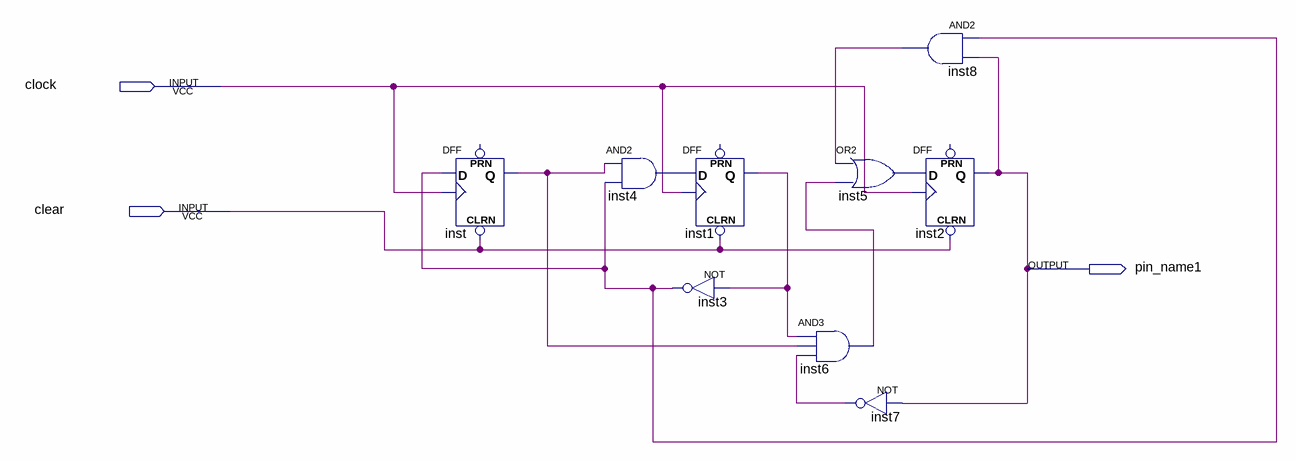
[diagram p0: schematic sheet]
// Quartus schematic Lab6.bdf as structural Verilog: 9 symbols, 3 pins
module Lab6 (
  input  clock,
  input  clear,
  output pin_name1
);

  wire inst1_q, inst3_out, inst4_out, inst5_out, inst6_out, inst7_out, inst8_out, inst_q;

  DFF inst (.CLRN(clear), .CLK(clock), .D(inst3_out), .Q(inst_q));  // open: PRN
  and inst4 (inst4_out, inst_q, inst3_out);
  DFF inst1 (.CLRN(clear), .CLK(clock), .D(inst4_out), .Q(inst1_q));  // open: PRN
  not inst3 (inst3_out, inst1_q);
  or inst5 (inst5_out, inst8_out, inst6_out);
  and inst6 (inst6_out, inst1_q, inst_q, inst7_out);
  not inst7 (inst7_out, pin_name1);
  and inst8 (inst8_out, inst3_out, pin_name1);
  DFF inst2 (.CLRN(clear), .CLK(clock), .D(inst5_out), .Q(pin_name1));  // open: PRN
endmodule
